# Altium schematic sheet TS-1002-070261_TS-1002-07026.schdoc
size 127 x 99 mm
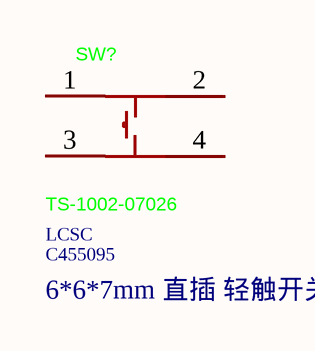
[diagram p0: TS-1002-070261_TS-1002-07026.schdoc]

## Parts
SW?  TS-1002-07026  Supplier: LCSC  Supplier Part: C455095  LCSC Part Name: 6*6*7mm 直插 轻触开关  [SW-TH_4P-L6.0-W6.0-P4.50-LS6.5]

## Nets

Not connected (* = marked no-connect by the designer): SW? 1 2 3 4

## Library data of the parts
SW? = TS-1002-07026: Manufacturer: XUNPU(讯普); Add into BOM: yes; Circuit: SPST; Actuator Style: Round Button; Switch Height: 7mm; Contact Current: 50mA; Voltage Rating: 12V; Symbol: TS-1002-07026; Device: TS-1002-07026; Manufacturer Part: TS-1002-07026; Supplier Footprint: 插件,6x6mm; JLCPCB Part Class: Extended Part; Datasheet: https://item.szlcsc.com/datasheet/TS-1002-07026/457500.html; Convert to PCB: yes; Mounting Type: Through Hole; Length: 6mm; Width: 6mm; With Lamp: -; Life: -